# EasyEDA schematic EasyEDA-Schematic.json
TITLE: USBtinyISP; REV: 1.0; Date: 2017-12-23; Sheet: 1/1; Drawn By: Julian Schuler
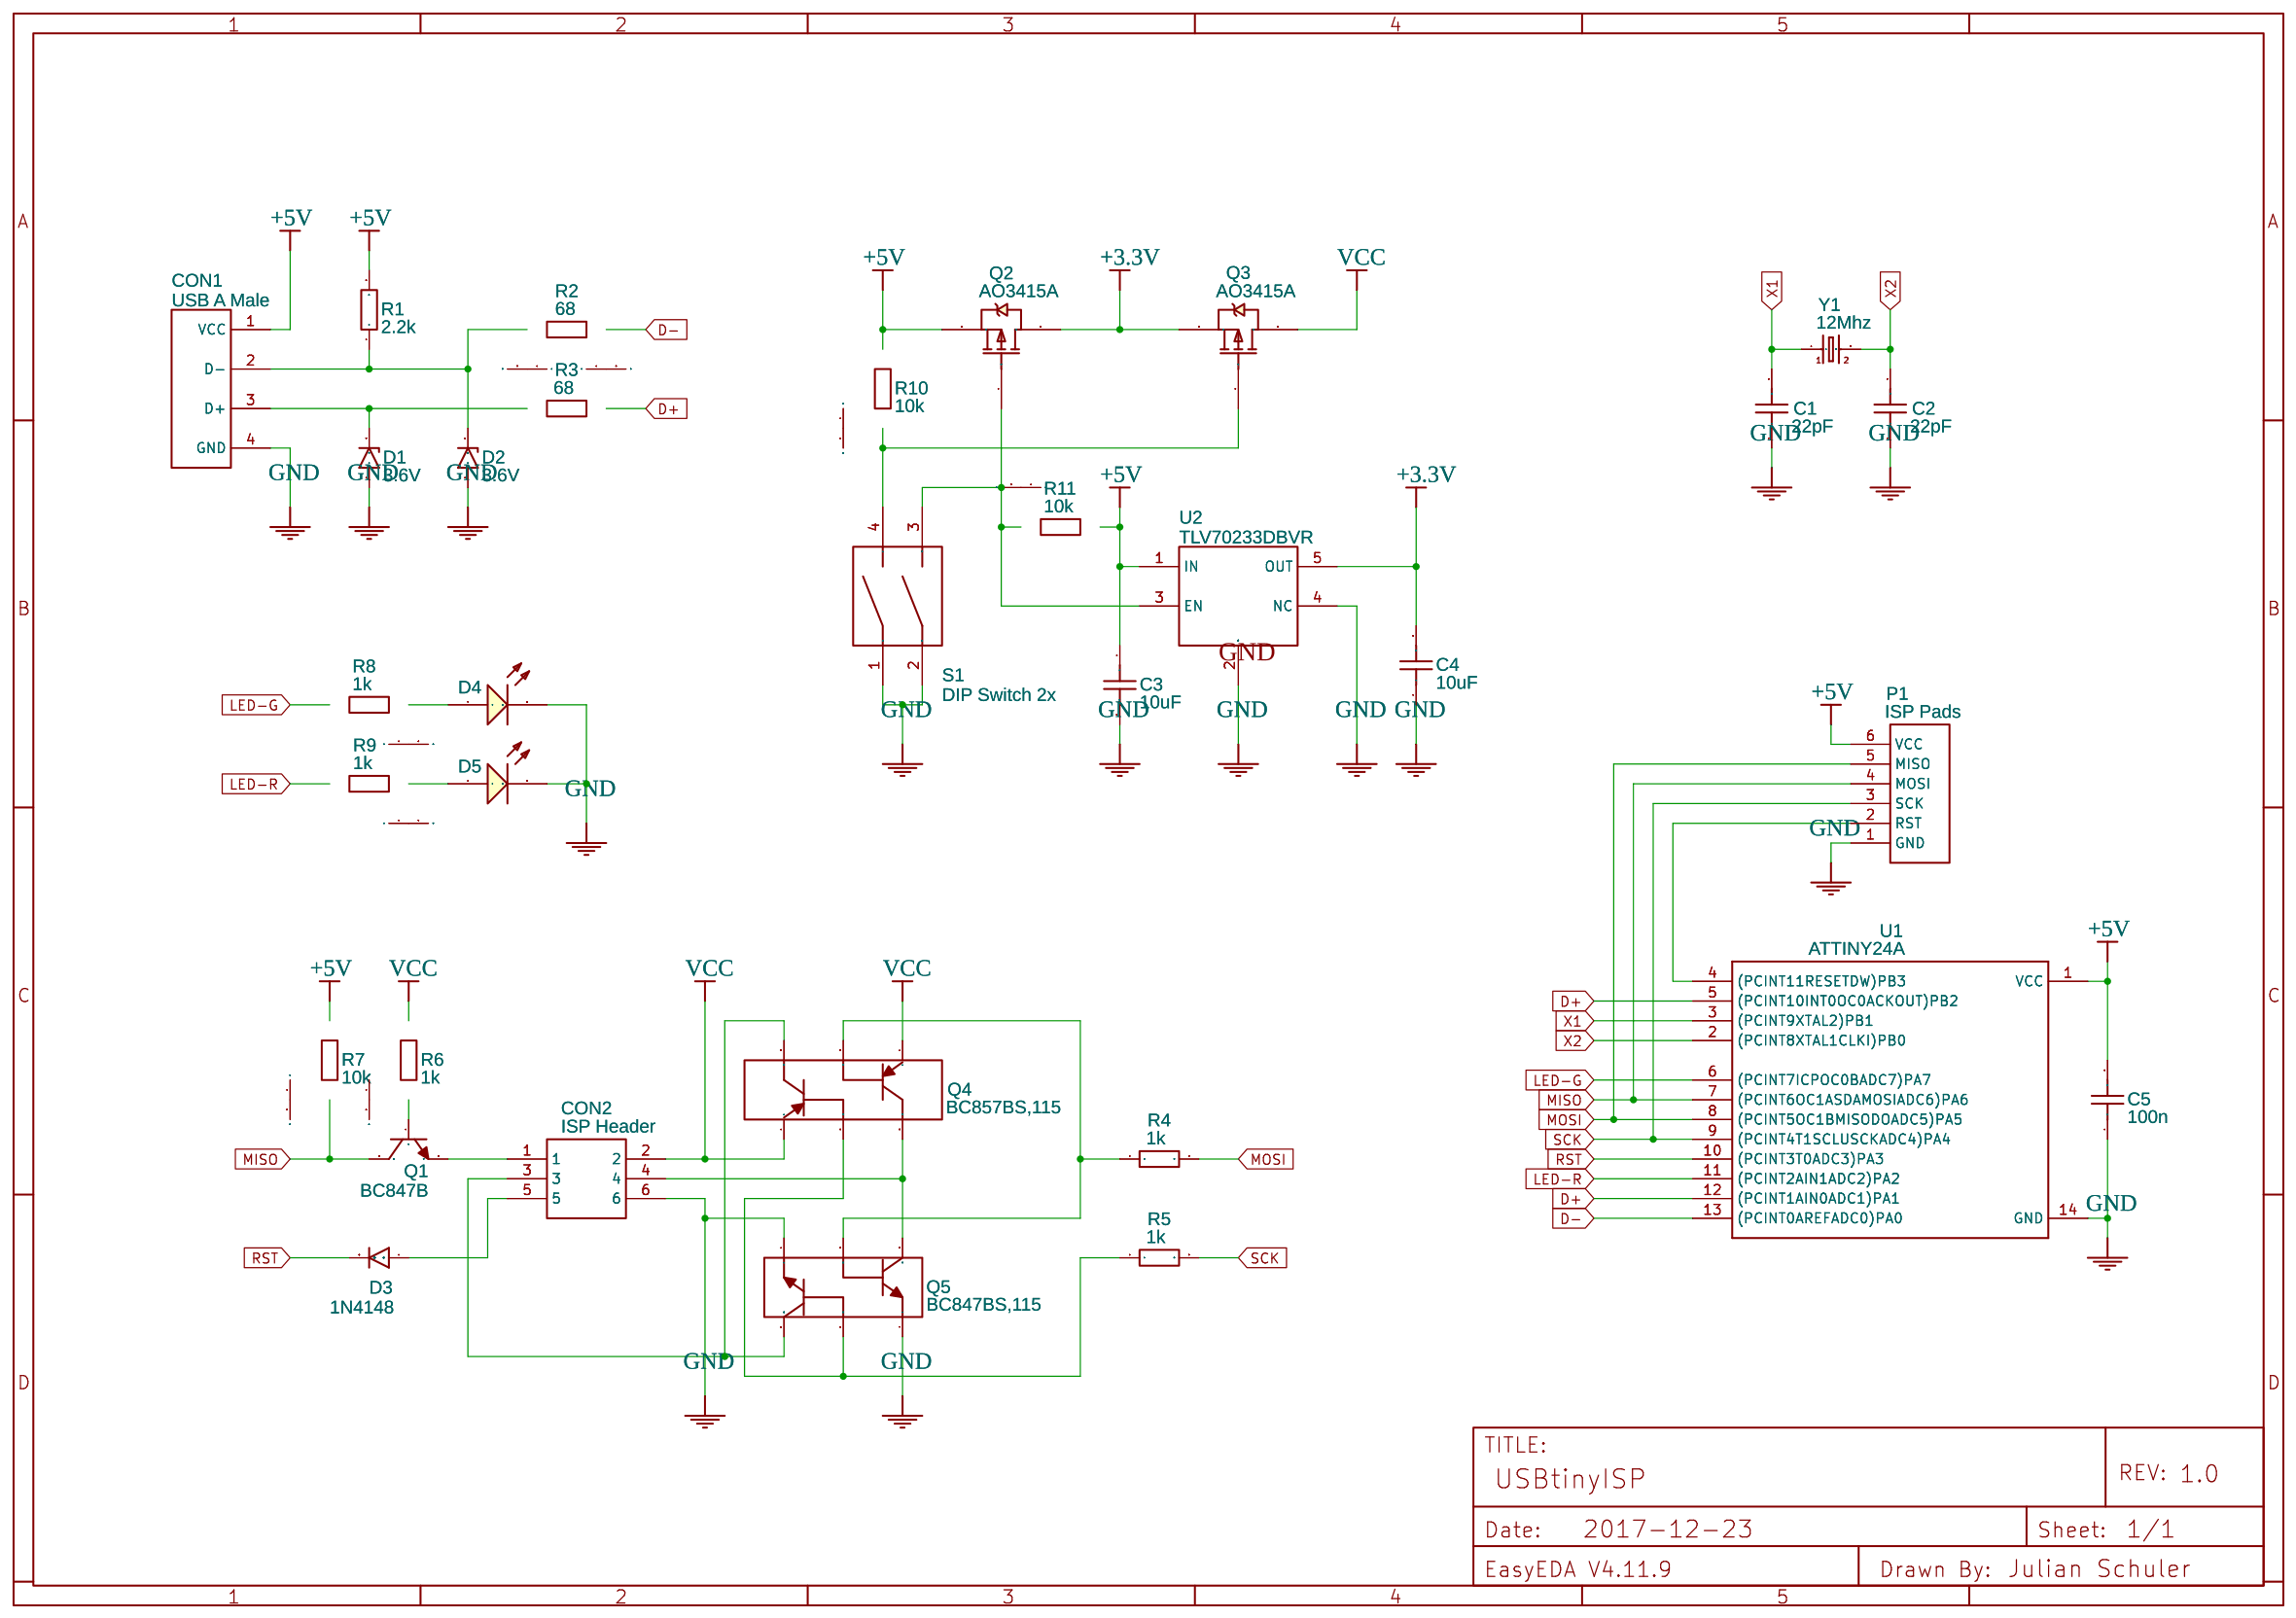
[diagram p0: schematic sheet]

## Parts
C1  22pF  [1206]
C2  22pF  [1206]
C3  10uF  [1206]
C4  10uF  [1206]
C5  100n  [1206]
CON1  USB A Male  [USB A MALE]
CON2  ISP Header  [ISP HEADER SIDEWAYS]
D1  3.6V  [LL-34]
D2  3.6V  [LL-34]
D3  1N4148  [LL-34]
D4  19-217/GHC-YR1S2/3T  [LED 3216 (1206)]
D5  Red(0603)  [LED 3216 (1206)]
P1  ISP Pads  [ISP PADS]
Q1  BC847B  [RSOT-23]
Q2  AO3415A  [RSOT-23]
Q3  AO3415A  [RSOT-23]
Q4  BC857BS,115  [SOT-363]
Q5  BC847BS,115  [SOT-363]
R1  2.2k  [1206]
R2  68  [1206]
R3  68  [1206]
R4  1k  [1206]
R5  1k  [1206]
R6  1k  [1206]
R7  10k  [1206]
R8  1k  [1206]
R9  1k  [1206]
R10  10k  [1206]
R11  10k  [1206]
S1  DIP Switch 2x  [DIP SWITCHES 2X]
U1  ATTINY24A  [SO14]
U2  TLV70233DBVR  [SOT23-5]
Y1  12Mhz  [HC49US]

## Library data of the parts
C1-C4 = Capacitor: Manufacturer Part: ?
C5 = Cap_1206_US: Manufacturer Part: ?
CON1 D1 D2 S1 = -: Contributor: Julian42; Manufacturer Part: ?
CON2 = -: Supplier: LCSC; Manufacturer: ReliaPro; Manufacturer Part: 2X3 2.54mm IDC Box; LCSC: C11214
D3 = -: catid: 20; Manufacturer Part: ?
D4 = -: LCSC: C72043; Supplier: LCSC; Manufacturer: EVERLIGHT
D5 = -: LCSC: C2286; Supplier: LCSC; Manufacturer: LCSC; Manufacturer Part: KT-0603R
P1 = -: Contributor: Julian42
Q1 = -: Supplier: LCSC; Manufacturer: NXP; LCSC: C57668
Q2 Q3 = -: LCSC: C2574; Supplier: LCSC; Manufacturer: IR; Manufacturer Part: IRF9530NPBF
Q4 = -: Supplier: LCSC; Manufacturer: Nexperia; LCSC: C8654; image: //image.lceda.cn/szlcsc/C8654.jpg
Q5 = -: Supplier: LCSC; Manufacturer: Nexperia; LCSC: C8653; image: //image.lceda.cn/szlcsc/C8653.jpg
R1-R11 = Resistor: Manufacturer Part: ?
U1 = -: catid: 20; Contributor: SparkFun; Manufacturer Part: ?
U2 = -: Single Output LDO, 300 mA, Fixed 3.3 V Output, 2 to 5.5 V Input, with Low IQ, 5-pin SOT-23 (DBV), -40 to 125 degC, Green (RoHS  no SbBr); catid: 20; Manufacturer Part: ?
Y1 = -: DIP Crystal 16MHz-18pF-30ppm-50R;; catid: 20; Manufacturer Part: 49S/18PF

## Nets
+3.3V: C4.2 Q2.3(D) Q3.2(S) U2.5(OUT)
+5V: C3.1 C5.2 CON1.1(VCC) P1.6(VCC) Q2.2(S) R1.2 R7.2 R10.2 R11.2 U1.1(VCC) U2.1(IN)
GND: C1.1 C2.1 C3.2 C4.1 C5.1 CON1.4(GND) CON2.6 D1.A D2.A D4.C D5.C P1.1(GND) Q5.1 Q5.4 S1.1 S1.2 U1.14(GND) U2.2(GND) U2.4(NC)
VCC: CON2.2 Q3.3(D) Q4.1 Q4.4 R6.2
D+: R3.2 U1.5((PCINT10INT0OC0ACKOUT)PB2) U1.12((PCINT1AIN0ADC1)PA1)
D-: R2.1 U1.13((PCINT0AREFADC0)PA0)
LED-G: R8.2 U1.6((PCINT7ICPOC0BADC7)PA7)
LED-R: R9.2 U1.11((PCINT2AIN1ADC2)PA2)
MISO: P1.4(MOSI) Q1.3 R7.1 U1.7((PCINT6OC1ASDAMOSIADC6)PA6)
MOSI: P1.5(MISO) R4.2 U1.8((PCINT5OC1BMISODOADC5)PA5)
RST: D3.C(CATHODE) U1.10((PCINT3T0ADC3)PA3)
SCK: P1.3(SCK) R5.2 U1.9((PCINT4T1SCLUSCKADC4)PA4)
X1: C1.2 U1.3((PCINT9XTAL2)PB1) Y1.1
X2: C2.2 U1.2((PCINT8XTAL1CLKI)PB0) Y1.2
CON2_1: CON2.1 Q1.2
CON2_3: CON2.3 Q4.6 Q5.6
CON2_4: CON2.4 Q4.3 Q5.3
CON2_5: CON2.5 D3.A(ANODE)
D1_C: CON1.3(D+) D1.C R3.1
D2_C: CON1.2(D-) D2.C R1.1 R2.2
D4_A: D4.A R8.1
D5_A: D5.A R9.1
Q1_1: Q1.1 R6.1
Q2_1: Q2.1(G) R11.1 S1.3 U2.3(EN)
Q3_1: Q3.1(G) R10.1 S1.4
Q4_2: Q4.2 Q5.2 R5.1
Q4_5: Q4.5 Q5.5 R4.1
U1_4: P1.2(RST) U1.4((PCINT11RESETDW)PB3)
